# Altium schematic sheet ALL_80_pins.SchDoc
size A2; DocumentNumber: 4; SheetNumber: 2; SheetTotal: 4
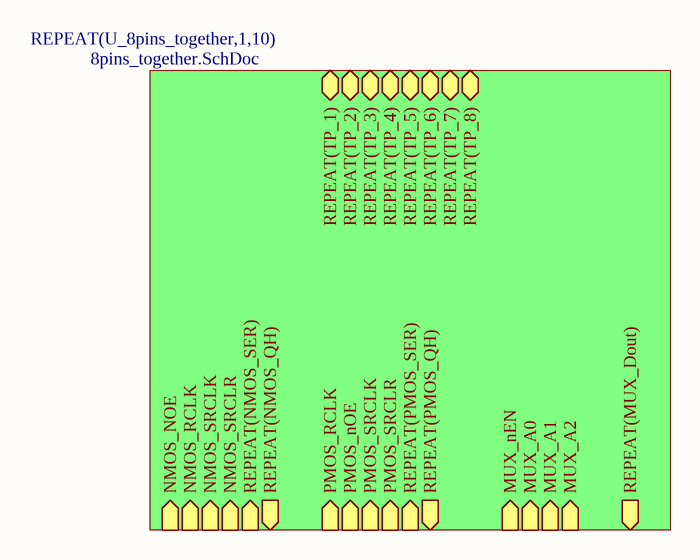
[diagram p0: ALL_80_pins.SchDoc]

## Sub-sheets
REPEAT(U_8pins_together,1,10) = 8pins_together.SchDoc: REPEAT(TP_1) (bidir), REPEAT(TP_2) (bidir), REPEAT(TP_3) (bidir), REPEAT(TP_4) (bidir), REPEAT(TP_5) (bidir), REPEAT(TP_6) (bidir), REPEAT(TP_7) (bidir), REPEAT(TP_8) (bidir), NMOS_RCLK (in), NMOS_NOE (in), NMOS_SRCLK (in), NMOS_SRCLR (in), REPEAT(NMOS_SER) (in), REPEAT(NMOS_QH) (out), PMOS_RCLK (in), PMOS_nOE (in), PMOS_SRCLK (in), PMOS_SRCLR (in), REPEAT(PMOS_SER) (in), REPEAT(PMOS_QH) (out), MUX_A0 (in), MUX_A1 (in), MUX_A2 (in), MUX_nEN (in), REPEAT(MUX_Dout) (out)